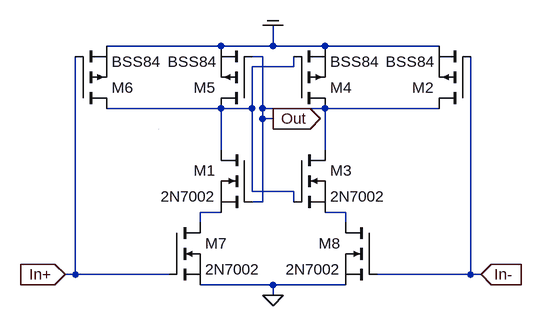
[diagram p0: schematic cmp.asc]
cmp.asc, the LTspice schematic file:
Version 4
SHEET 1 880 680
WIRE 96 -128 -80 -128
WIRE 176 -128 176 -160
WIRE 176 -128 96 -128
WIRE 256 -128 176 -128
WIRE 432 -128 256 -128
WIRE 160 -112 144 -112
WIRE 208 -96 208 -112
WIRE 208 -96 144 -96
WIRE 96 -32 -80 -32
WIRE 144 -32 144 -96
WIRE 144 -32 96 -32
WIRE 160 -32 160 -112
WIRE 256 -32 160 -32
WIRE 432 -32 256 -32
WIRE 160 -16 160 -32
WIRE 176 -16 160 -16
WIRE 96 32 96 -32
WIRE 256 32 256 -32
WIRE 144 96 144 -32
WIRE 208 96 144 96
WIRE 160 112 160 -16
WIRE 160 112 144 112
WIRE 208 112 208 96
WIRE 96 128 64 128
WIRE 288 128 256 128
WIRE 64 144 64 128
WIRE 288 144 288 128
WIRE -128 224 -128 -112
WIRE -128 224 -144 224
WIRE 16 224 -128 224
WIRE 480 224 480 -112
WIRE 480 224 336 224
WIRE 496 224 480 224
WIRE 176 240 64 240
WIRE 288 240 176 240
WIRE 176 256 176 240
WIRE 0 0 0 0
FLAG 496 224 In-
IOPIN 496 224 In
FLAG 176 -16 Out
IOPIN 176 -16 Out
FLAG 176 -160 COM
FLAG -144 224 In+
IOPIN -144 224 In
FLAG 176 256 0
SYMBOL nmos 144 32 M0
SYMATTR InstName M1
SYMATTR Value 2N7002
SYMBOL nmos 208 32 R0
SYMATTR InstName M3
SYMATTR Value 2N7002
SYMBOL pmos 144 -32 R180
SYMATTR InstName M5
SYMATTR Value BSS84
SYMBOL pmos -128 -32 M180
SYMATTR InstName M6
SYMATTR Value BSS84
SYMBOL pmos 480 -32 R180
SYMATTR InstName M2
SYMATTR Value BSS84
SYMBOL pmos 208 -32 M180
SYMATTR InstName M4
SYMATTR Value BSS84
SYMBOL nmos 16 144 R0
SYMATTR InstName M7
SYMATTR Value 2N7002
SYMBOL nmos 336 144 M0
SYMATTR InstName M8
SYMATTR Value 2N7002

The netlist it stands for:
* cmp.asc
M1 N001 Out N002 N002 2N7002
M3 Out N001 N003 N003 2N7002
M5 N001 Out COM COM BSS84
M6 N001 In+ COM COM BSS84
M2 Out In- COM COM BSS84
M4 Out N001 COM COM BSS84
M7 N002 In+ 0 0 2N7002
M8 N003 In- 0 0 2N7002
.model NMOS NMOS
.model PMOS PMOS
.lib standard.mos
.backanno
.end